# Altium schematic sheet DaughterBoard.SchDoc
size A4
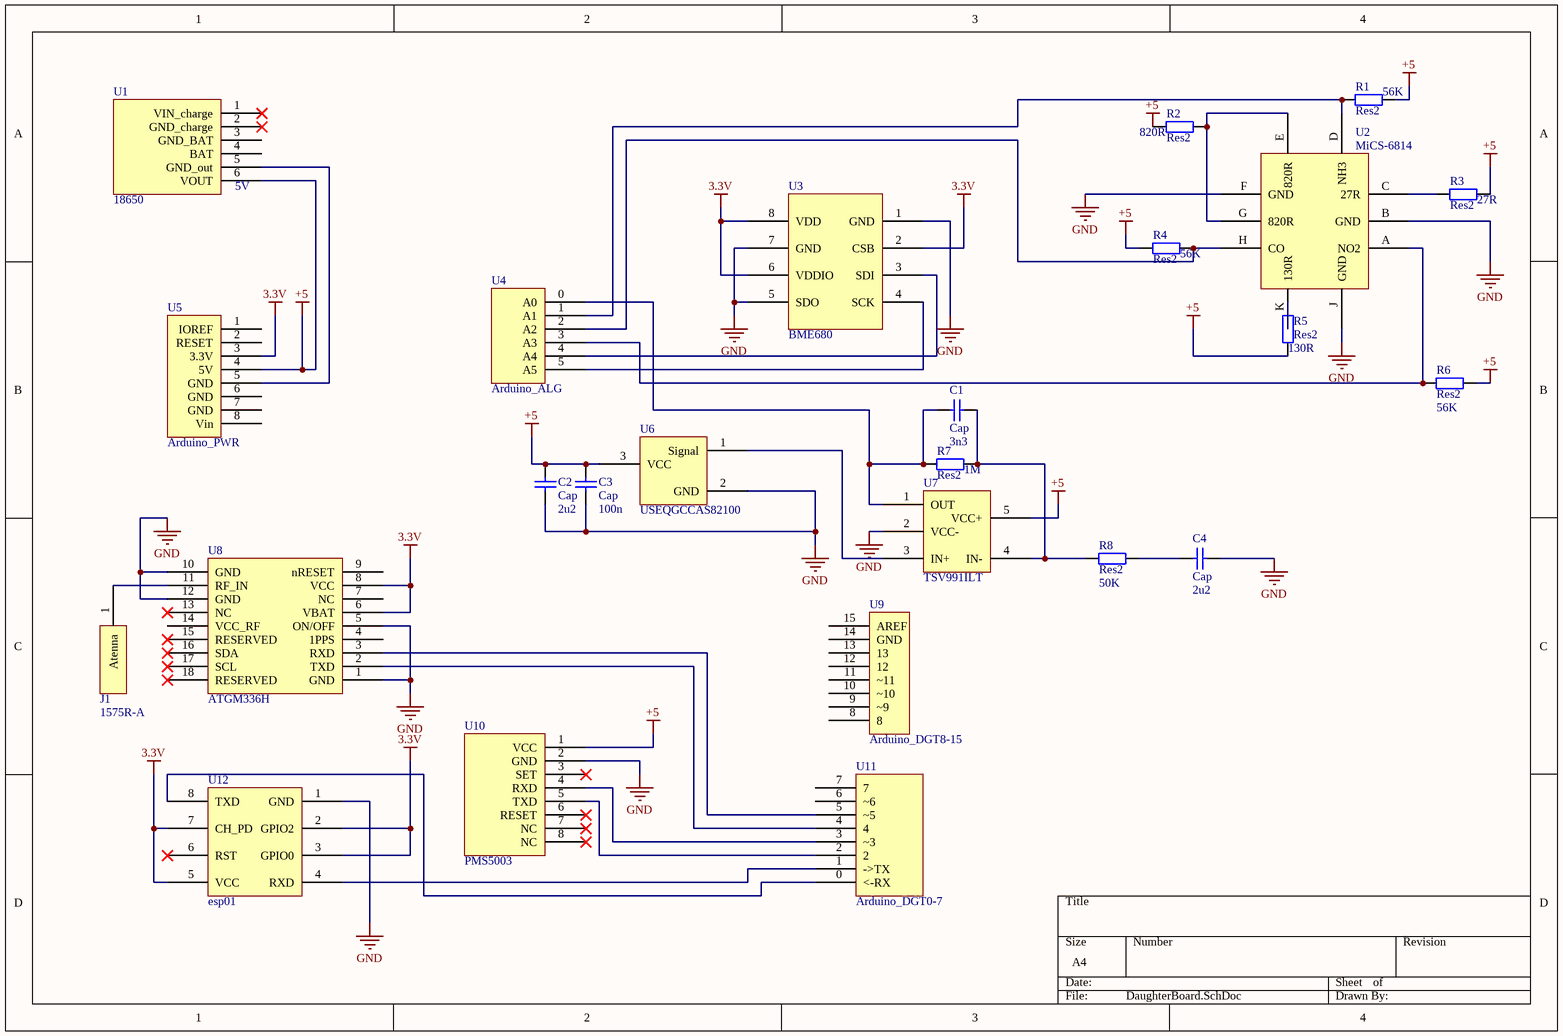
[diagram p0: DaughterBoard.SchDoc]

## Parts
C1  Cap  value 3n3  [RAD-0.3]
C2  Cap  value 2u2  [RAD-0.3]
C3  Cap  value 100n  [RAD-0.3]
C4  Cap  value 2u2  [RAD-0.3]
J1  1575R-A
R1  Res2  value 56K  [AXIAL-0.4]
R2  Res2  value 820R  [AXIAL-0.4]
R3  Res2  value 27R  [AXIAL-0.4]
R4  Res2  value 56K  [AXIAL-0.4]
R5  Res2  value 130R  [AXIAL-0.4]
R6  Res2  value 56K  [AXIAL-0.4]
R7  Res2  value 1M  [AXIAL-0.4]
R8  Res2  value 50K  [AXIAL-0.4]
U1  18650
U2  MiCS-6814
U3  BME680
U4  Arduino_ALG
U5  Arduino_PWR
U6  USEQGCCAS82100
U7  TSV991ILT
U8  ATGM336H
U9  Arduino_DGT8-15
U10  PMS5003
U11  Arduino_DGT0-7
U12  esp01

## Nets
3.3V: U3.2(CSB) U3.6(VDDIO) U3.8(VDD) U5.3(3.3V) U8.6(VBAT) U8.8(VCC) U12.2(GPIO2) U12.3(GPIO0) U12.5(VCC) U12.7(CH_PD)
+5: C2.2 C3.2 R1.1 R2.1 R3.2 R4.1 R5.1 R6.1 U1.6(VOUT) U5.4(5V) U6.3(VCC) U7.5(VCC+) U10.1(VCC)
GND: C2.1 C3.1 C4.2 U2.B(GND) U2.F(GND) U2.J(GND) U3.1(GND) U3.5(SDO) U3.7(GND) U6.2(GND) U7.2(VCC-) U8.1(GND) U8.5(ON/OFF) U8.10(GND) U8.12(GND) U10.2(GND) U12.1(GND)
NetC1_1: C1.1 R7.2 R8.2 U7.4(IN-)
NetC1_2: C1.2 R7.1 U4.0(A0) U7.1(OUT)
NetC4_1: C4.1 R8.1
NetJ1_1: J1.1(Atenna) U8.11(RF_IN)
NetR1_2: R1.2 U2.D(NH3) U4.1(A1)
NetR2_2: R2.2 U2.E(820R) U2.G(820R)
NetR3_1: R3.1 U2.C(27R)
NetR4_2: R4.2 U2.H(CO) U4.2(A2)
NetR5_2: R5.2 U2.K(130R)
NetR6_2: R6.2 U2.A(NO2) U4.3(A3)
NetU1_5: U1.5(GND_out) U5.5(GND)
NetU3_3: U3.3(SDI) U4.4(A4)
NetU3_4: U3.4(SCK) U4.5(A5)
NetU6_1: U6.1(Signal) U7.3(IN+)
NetU8_2: U8.2(TXD) U11.4
NetU8_3: U8.3(RXD) U11.5(~5)
NetU10_4: U10.4(RXD) U11.3(~3)
NetU10_5: U10.5(TXD) U11.2
NetU11_0: U11.0(<-RX) U12.8(TXD)
NetU11_1: U11.1(->TX) U12.4(RXD)

Not connected (* = marked no-connect by the designer): U1 1(VIN_charge)* 2(GND_charge)* 3(GND_BAT) 4(BAT); U5 1(IOREF) 2(RESET) 6(GND) 7(GND) 8(Vin); U8 4(1PPS) 7(NC) 9(nRESET) 13(NC)* 14(VCC_RF) 15(RESERVED)* 16(SDA)* 17(SCL)* 18(RESERVED)*; U9 8 9(~9) 10(~10) 11(~11) 12 13 14(GND) 15(AREF); U10 3(SET)* 6(RESET)* 7(NC)* 8(NC)*; U11 6(~6) 7; U12 6(RST)*

## Notes on the sheet
- (near U1) 5V

## Library data of the parts
C1-C4 = Cap: Capacitor; Published: 8-Jun-2000; LatestRevisionDate: 17-Jul-2002; LatestRevisionNote: Re-released for DXP Platform.; PackageReference: RAD-0.3; Publisher: Altium Limited; PackageDescription: Radial Cap, Thru-Hole; 2 Leads; 0.3 in Pin Spacing
R1-R8 = Res2: Resistor; Published: 8-Jun-2000; LatestRevisionDate: 17-Jul-2002; LatestRevisionNote: Re-released for DXP Platform.; PackageReference: AXIAL-0.4; Publisher: Altium Limited; PackageDescription: Axial Device, Thru-Hole; 2 Leads; 0.4 in Pin Spacing